# Altium schematic sheet [1] Slave.SchDoc
size A4
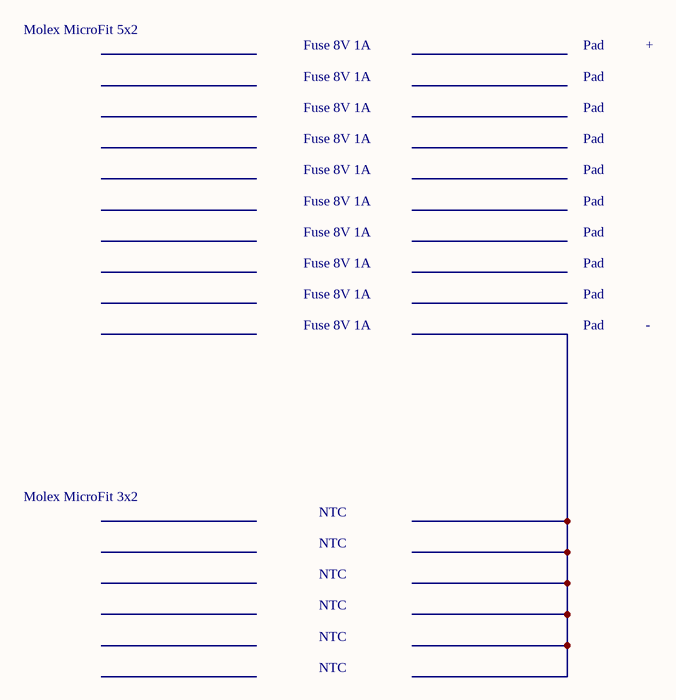
[diagram p0: [1] Slave.SchDoc]

## Notes on the sheet
- Molex MicroFit 5x2
- Fuse 8V 1A
- Pad
- +
- -
- Molex MicroFit 3x2
- NTC
- Title
- Size:
- Date:
- A4
- Number:
- Time:
- Revision:
- Sheet
- of
- File: